# EAGLE design MINI54_breakout (EAGLE 7.4.0)
OBC with integrated microcontroller
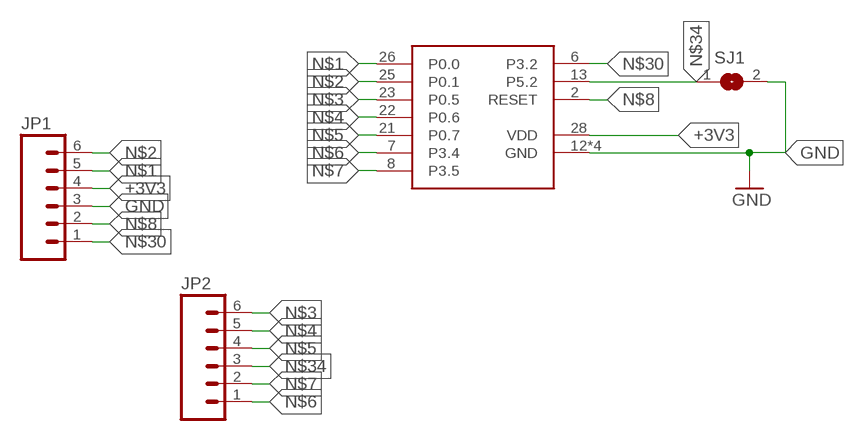
[diagram p0: schematic, sheet 1]

## Parts
JP1  M06LONGPADS  [1X06_LONGPADS]
JP2  M06LONGPADS  [1X06_LONGPADS]
SJ1  SJ  [SJ]
U$9  MINITAN54-QFN  [QFN50P500X500X100-33N]

## Nets
+3V3: JP1.4 U$9.28(VDD)
GND: JP1.3 SJ1.2 U$9.12(GND) U$9.17(GND) U$9.32(GND) U$9.33(GND)
N$1: JP1.5 U$9.26(P0.0)
N$2: JP1.6 U$9.25(P0.1)
N$3: JP2.6 U$9.23(P0.5)
N$4: JP2.5 U$9.22(P0.6)
N$5: JP2.4 U$9.21(P0.7)
N$6: JP2.1 U$9.7(P3.4)
N$7: JP2.2 U$9.8(P3.5)
N$8: JP1.2 U$9.2(RESET)
N$30: JP1.1 U$9.6(P3.2)
N$34: JP2.3 SJ1.1 U$9.13(P5.2)

## Library data of the parts
JP1 JP2 = SparkFun-Connectors:M06: Header 6 Standard 6-pin 0.1" header. Use with straight break away headers (SKU : PRT-00116), right angle break away headers (PRT-00553), swiss pins (PRT-00743), machine pins (PRT-00117), and female headers (PRT-00115). Molex polarized connector foot print use with SKU : PRT-08094 with associated crimp pins and housings. NOTES ON THE VARIANTS LOCK and LOCK_LONGPADS... This footprint was designed to help hold the alignment of a through-hole component (i.e. 6-pin header) while soldering it into place. You may notice that each hole has been shifted either up or down by 0.005 of an inch from it's more standard position (which is a perfectly straight line). This slight alteration caused the pins (the squares in the middle) to touch the edges of the holes. Because they are alternating, it causes a "brace" to hold the component in place. 0.005 has proven to be the perfect amount of "off-center" position when using our standard breakaway headers. Although looks a little odd when you look at the bare footprint, once you have a header in there, the alteration is very hard to notice. Also,if you push a header all the way into place, it is covered up entirely on the bottom side. This idea of altering the position of holes to aid alignment will be further integrated into the Sparkfun Library for other footprints. It can help hold any component with 3 or more connection pins.
SJ1 = jumper:SJ: SMD solder JUMPER
U$9 = Teensy_3_Series_Chip_v1.2:MINITAN54-QFN: This is the 5x5mm 33-pin QFN version of the Minitan54 bootloader from PJRC.com

## Net classes
1 USB: width 0.254 mm, clearance 0.159 mm

## Board
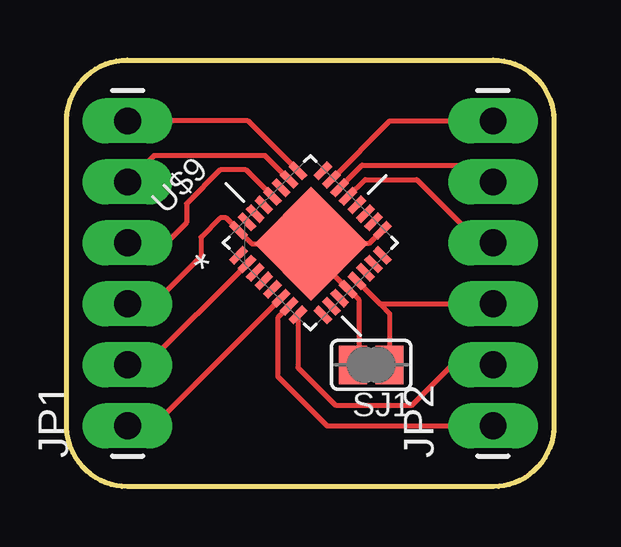
[diagram p1: board, top side]

Size 20.32 x 17.78 mm. Coordinates in mm from the lower left corner, seen from the top.
Outline: 0,2.54 0,15.24 arc-90 2.54,17.78 17.78,17.78 arc-90 20.32,15.24 20.32,2.54 arc-90 17.78,0 2.54,0 arc-90 0,2.54
Copper layers (1*16): Top 0.035mm / dielectric 1.5mm / Bottom 0.035mm
Design rules "pcbtrain *": minimum track width 0.2mm, minimum drill 0.4mm, track to track 0.2mm, track to pad 0.2mm, pad to pad 0.2mm, via to via 0.2mm, smd to smd 0mil, copper to edge 10mil, drill to drill 0.2mm, minimum pad ring 10mil, minimum via ring 10mil, stop-mask expansion 0.125mm, vias tented up to drill 25mil, thermal gap 10mil

### Footprints (pad centres in the part's own frame; a part is rotated, then mirrored left to right if it is on the bottom)
1X06_LONGPADS = drill 1.118 pad 1.88 long: 1 0,0; 2 2.54,0; 3 5.08,0; 4 7.62,0; 5 10.16,0; 6 12.7,0
SJ = smd 1.168 x 1.6: 1 -0.762,0; 2 0.762,0
QFN50P500X500X100-33N = smd 0.813 x 0.305: 1 -2.489,1.753; 2 -2.489,1.245; 3 -2.489,0.762; 4 -2.489,0.254; 5 -2.489,-0.254; 6 -2.489,-0.762; 7 -2.489,-1.245; 8 -2.489,-1.753; 17 2.489,-1.753; 18 2.489,-1.245; 19 2.489,-0.762; 20 2.489,-0.254; 21 2.489,0.254; 22 2.489,0.762; 23 2.489,1.245; 24 2.489,1.753 | smd 0.305 x 0.813: 9 -1.753,-2.489; 10 -1.245,-2.489; 11 -0.762,-2.489; 12 -0.254,-2.489; 13 0.254,-2.489; 14 0.762,-2.489; 15 1.245,-2.489; 16 1.753,-2.489; 25 1.753,2.489; 26 1.245,2.489; 27 0.762,2.489; 28 0.254,2.489; 29 -0.254,2.489; 30 -0.762,2.489; 31 -1.245,2.489; 32 -1.753,2.489 | smd 3.353 x 3.353: 33 0,-0.051

### Placement (x,y rotation side)
JP1  2.54,2.54 90 top
JP2  17.78,2.54 90 top
SJ1  12.7,5.08 180 top
U$9  10.16,10.16 45 top

### Tracks (layer width: path | path; a pad name or v marks a point on that pad's centre or on a via)
+3V3
  Top 0.2: U$9.28 7.48,13.2 6.4,13.2 5,11.8 5,11 4.16,10.16 JP1.4
GND
  Top 0.2: U$9.33 7.72,10.12 U$9.32 6.64,11.2 6.4,11.2 5.6,10.4 5.6,9.6 3.62,7.62 JP1.3 | U$9.17 12.6,10.12 U$9.33 | U$9.33 10.2,9.77 U$9.12 12.2,7.76 12.2,5.34 SJ1.2
N$1
  Top 0.2: U$9.26 8.28,13.8 3.64,13.8 JP1.5
N$2
  Top 0.2: U$9.25 7.56,15.24 JP1.6
N$3
  Top 0.2: U$9.23 13.48,15.24 JP2.6
N$4
  Top 0.2: U$9.22 12.32,13.4 17.08,13.4 JP2.5
N$5
  Top 0.2: U$9.21 12.44,12.8 14.6,12.8 17.24,10.16 JP2.4
N$6
  Top 0.2: U$9.7 8.8,7.04 8.8,4.6 10.86,2.54 JP2.1
N$7
  Top 0.2: U$9.8 9.64,4.96 11.2,3.4 14.4,3.4 16.08,5.08 JP2.2
N$8
  Top 0.2: U$9.2 3.32,5.08 JP1.2
N$30
  Top 0.2: U$9.6 3.62,2.54 JP1.1
N$34
  Top 0.2: U$9.13 13.06,7.62 | 13.06,7.62 JP2.3 | 13.06,7.62 13.46,7.22 SJ1.1